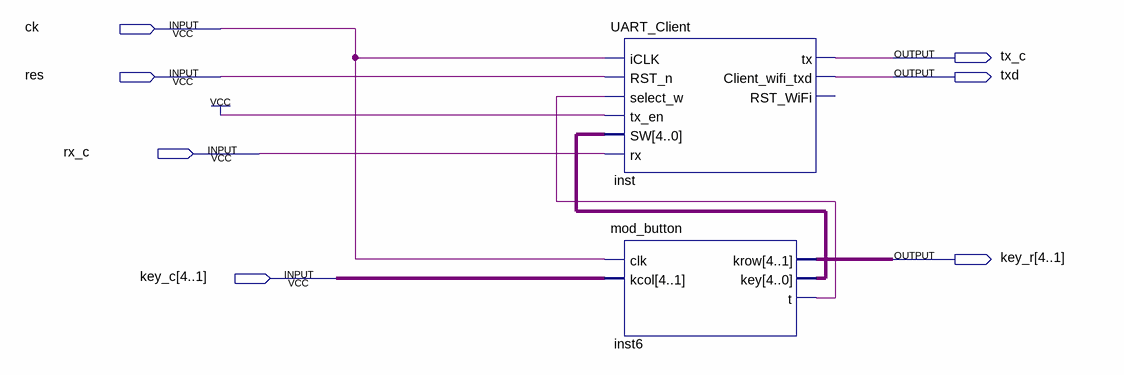
[diagram p0: schematic sheet]
// Quartus schematic top.bdf as structural Verilog: 2 symbols, 7 pins
module top (
  input  ck,
  input  res,
  input  rx_c,
  input  [4:1] key_c,
  output tx_c,
  output txd,
  output [4:1] key_r
);

  wire inst6_t;
  wire [4:0] inst6_key;

  UART_Client inst (
    .iCLK(ck), .RST_n(res), .select_w(inst6_t), .tx_en(1'b1), .SW(inst6_key), .rx(rx_c), .tx(tx_c),
    .Client_wifi_txd(txd));  // open: RST_WiFi
  mod_button inst6 (.clk(ck), .kcol(key_c), .krow(key_r), .key(inst6_key), .t(inst6_t));
endmodule
